# Altium schematic sheet Power_Supply_2.SchDoc
size A4
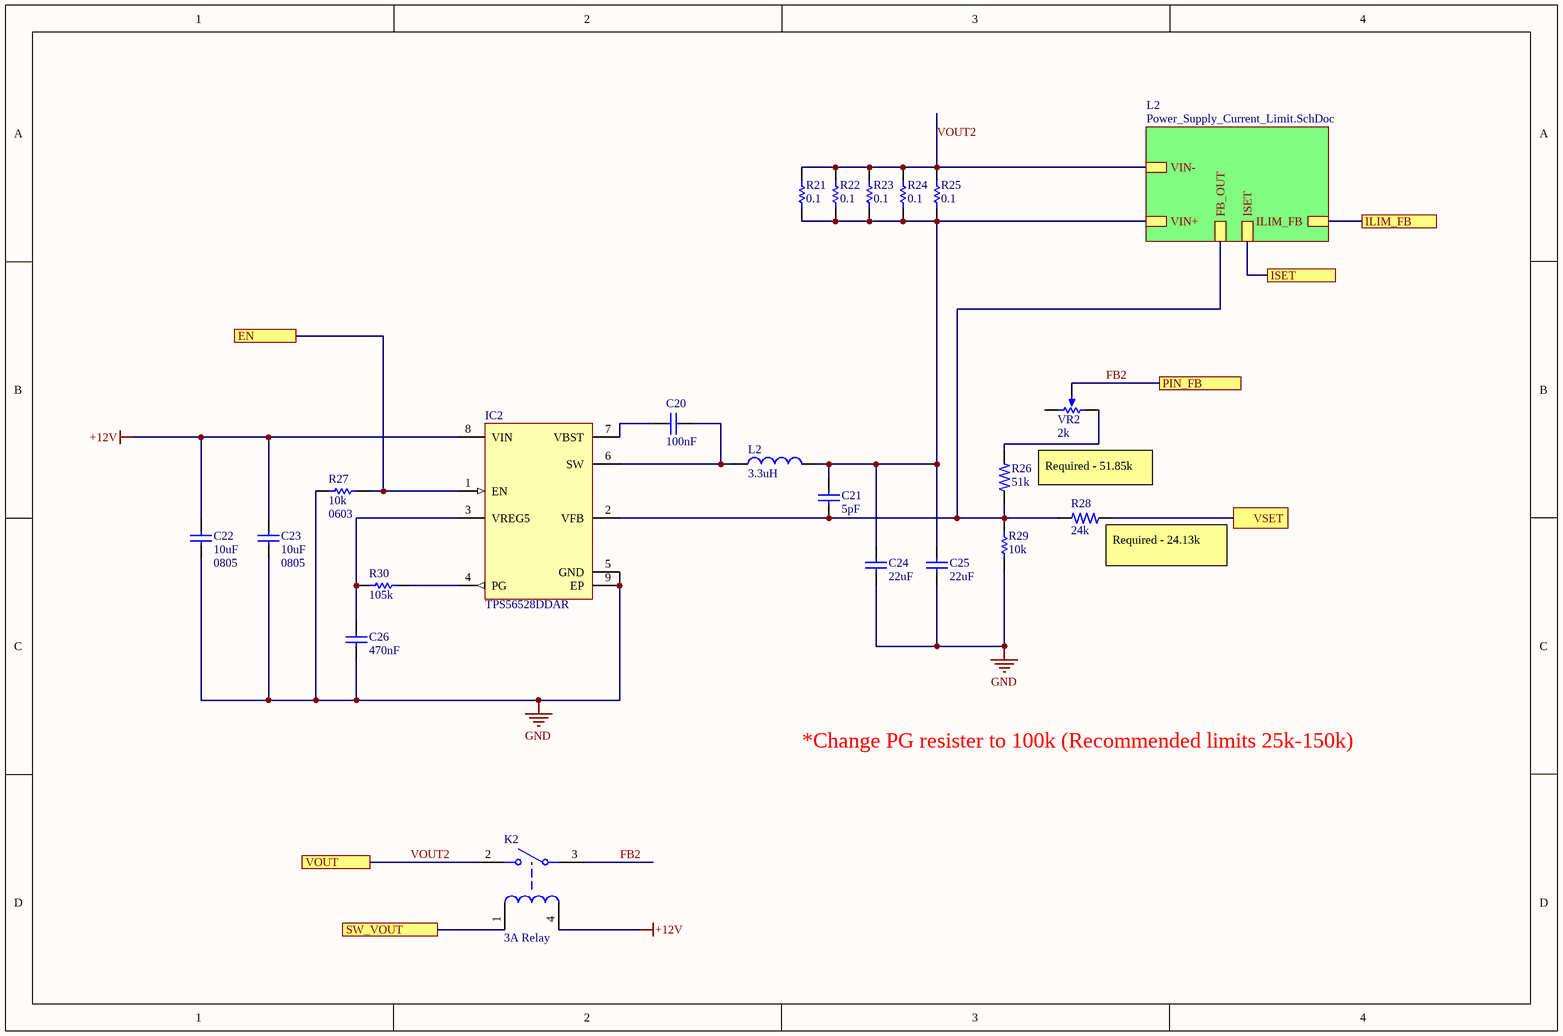
[diagram p0: Power_Supply_2.SchDoc]

## Parts
C20  100nF  [CAPC1608X09N]
C21  5pF  [CAPC1608X09N]
C22  10uF  Package / Case: 0805  [C0805]
C23  10uF  Package / Case: 0805  [C0805]
C24  22uF  [CAPC1608X09N]
C25  22uF  [CAPC1608X09N]
C26  470nF  [CAPC1608X09N]
IC2  TPS56528DDAR  [PCB-duyb6heo4lj5grkfxin6-1]
K2  3A Relay  [PCB-ei6nokn2irsc2a7yt94x-1]
L2  3.3uH  [PCB-grsryisdn8451x3s484y-1]
R21  0.1  [RESC3116X07M]
R22  0.1  [RESC3116X07M]
R23  0.1  [RESC3116X07M]
R24  0.1  [RESC3116X07M]
R25  0.1  [RESC3116X07M]
R26  51k  [PCB-3elf45qdqizoabmczrxc-1]
R27  10k  Package / Case: 0603  [gen0603-2]
R28  24k  [PCB-3elf45qdqizoabmczrxc-1]
R29  10k  [gen0603-2]
R30  105k  [gen0603-2]
VR2  2k  [PCB-5abvnr99iwiiosfurk6j-1]

## Sub-sheets
L2 = Power_Supply_Current_Limit.SchDoc: VIN-, FB_OUT, VIN+, ISET, ILIM_FB

## Ports
EN, ILIM_FB, ISET, PIN_FB, SW_VOUT, VOUT, VSET

## Nets
+12V: C22.2 C23.2 IC2.8(VIN) K2.4
GND: C22.1 C23.1 C24.1 C25.1 C26.1 IC2.5(GND) IC2.9(EP) R27.2 R29.1
EN: IC2.1(EN) R27.1 ; port EN
FB2: K2.3 VR2.2(WIPER) ; port PIN_FB
ILIM_FB: port ILIM_FB, sheet L2/ILIM_FB
ISET: port ISET, sheet L2/ISET
SW_VOUT: K2.1 ; port SW_VOUT
VOUT2: K2.2 R21.1 R22.2 R23.2 R24.2 R25.2 ; port VOUT, sheet L2/VIN-
VSET: R28.1 ; port VSET
NetC20_1: C20.1 IC2.6(SW) L2.1
NetC20_2: C20.2 IC2.7(VBST)
NetC21_1: C21.1 IC2.2(VFB) R26.1 R28.2 R29.2 ; sheet L2/FB_OUT
NetC21_2: C21.2 C24.2 C25.2 L2.2 R21.2 R22.1 R23.1 R24.1 R25.1 ; sheet L2/VIN+
NetC26_2: C26.2 IC2.3(VREG5) R30.2
NetIC2_4: IC2.4(PG) R30.1
NetR26_2: R26.2 VR2.3(CW)

Not connected (* = marked no-connect by the designer): VR2 1(CCW)

## Notes on the sheet
- Required - 51.85k
- (near R28) Required - 24.13k
- *Change PG resister to 100k (Recommended limits 25k-150k)

## Library data of the parts
C20 = CMP-2f55e5122ad9f092-5: 0603 10 nF 50 V ± 10% Tolerance X7R Surface Mount Multilayer Ceramic Capacitor; Manufacture Part Number: CC0603KRX7R9BB104; Manufacturer: YAGEO; Voltage-Rated: 50V; Capacitance Tolerance: 10%; Capacitance: 100nF; Package / Case: 0603; Supplier: LCSC; Supplier Part Number: C14663
C21 = CMP-2f55e5122ad9f092-5: 0603 10 nF 50 V ± 10% Tolerance X7R Surface Mount Multilayer Ceramic Capacitor; Manufacture Part Number: CL10C050CB8NNNC; Manufacturer: Samsung Electro-Mechanics; Capacitance Tolerance: 0.25%; Voltage-Rated: 50V; Capacitance: 5pF; Package / Case: 0603; Supplier: LCSC; Supplier Part Number: C93045
C22 C23 = CMP-135114-3: Cap Ceramic 0.1uF 50V X7R 10% SMD 0805 125C Embossed T/R; Manufacture Part Number: CL21B106KOQNNNE; Manufacturer: Samsung Electro-Mechanics; Voltage-Rated: 16V; Capacitance Tolerance: *; Capacitance: 10uF; Supplier: LCSC; Supplier Part Number: C95841
C24 C25 = CMP-2f55e5122ad9f092-5: 0603 10 nF 50 V ± 10% Tolerance X7R Surface Mount Multilayer Ceramic Capacitor; Manufacture Part Number: CL10A226MP8NUNE; Manufacturer: Samsung Electro-Mechanics; Capacitance Tolerance: 20%; Voltage-Rated: 10V; Capacitance: 22uF; Package / Case: 0603; Supplier: LCSC; Supplier Part Number: C86295
C26 = CMP-2f55e5122ad9f092-5: 0603 10 nF 50 V ± 10% Tolerance X7R Surface Mount Multilayer Ceramic Capacitor; Manufacture Part Number: CL10F474ZO8NNNC; Manufacturer: Samsung Electro-Mechanics; Voltage-Rated: 16V; Capacitance Tolerance: 10%; Capacitance: 470nF; Package / Case: 0603; Supplier: LCSC; Supplier Part Number: C318652
IC2 = CMP-073acf9bf38cd8fd-4: 4.5V to 18V Input, 5-A Synchronous Step-Down Converter with Advanced Eco-mode™ 8-SO PowerPAD -40 to 125; Manufacturer: Texas Instruments; Topology: Buck; Number of Regulated Outputs: 1; RoHS: Compliant; Manufacture Part Number: TPS56528DDAR; Supplier: LCSC; Supplier Part Number: C138716
K2 = CMP-edc624afa9603201-3: Power Relay 12VDC 3DC/5AAC SPST-NO( (20.5mm 7.2mm 15.3mm)) THT; Manufacturer: Omron Electronics; Manufacture Part Number: G5NB-1A-E-DC12; Supplier: LCSC; Supplier Part Number: C225714; Current-Rated: 3A
L2 = CMP-nvsrvemexzuzshl0ucuq-1: 3.3uH ±20% 10A 11.8m? Power Inductors; Manufacturer: SXN; Manufacture Part Number: SMMS1040-3R3M; Supplier: LCSC; Supplier Part Number: C149592; Inductance: 3.3uH; Rated Current: 10A
R21-R25 = CMP-90ca5a8d69034f0d-5: Res Thick Film 3.2 x 1.6 mm 10K Ohm 1% 0.25W(1/4W) 100ppm/ C Molded SMD Paper T/R; Manufacture Part Number: 1206W4F100LT5E; Manufacturer: UNI-ROYAL(Uniroyal Elec); Package / Case: 1206; Resistance: 0.1; Resistance Tolerance: 1%; Supplier: LCSC; Supplier Part Number: C25334
R26 = CMP-1853278-23: Surface Mount Thick Film Resistor, RC Series, 1 kohm, 100 mW, - 1%, 50 V, 0603 [1608 Metric]; Manufacturer: Walsin Tech Group; Manufacture Part Number: WR06X513 JTL; Resistance Tolerance: 1%; Package / Case: 0603; Resistance: 51k; Supplier: LCSC; Supplier Part Number: C384211
R27 R29 = CMP-1853278-27: Surface Mount Thick Film Resistor, RC Series, 1 kohm, 100 mW, - 1%, 50 V, 0603 [1608 Metric]; Manufacturer: YAGEO; Manufacture Part Number: RC0603FR-0710KL; Resistance Tolerance: 1%; Supplier: LCSC; Supplier Part Number: C98220; Resistance: 10k
  R29: Package / Case: 0603
R28 = CMP-1853278-23: Surface Mount Thick Film Resistor, RC Series, 1 kohm, 100 mW, - 1%, 50 V, 0603 [1608 Metric]; Manufacturer: UNI-ROYAL(Uniroyal Elec); Manufacture Part Number: 0603WAJ0243T5E; Resistance Tolerance: 1%; Package / Case: 0603; Resistance: 24k; Supplier: LCSC; Supplier Part Number: C25588
R30 = CMP-1853278-27: Surface Mount Thick Film Resistor, RC Series, 1 kohm, 100 mW, - 1%, 50 V, 0603 [1608 Metric]; Manufacturer: UNI-ROYAL; Manufacture Part Number: 0603WAF1053T5E; Resistance Tolerance: 1%; Supplier: LCSC; Supplier Part Number: C16840; Resistance: 105k; Package / Case: 0603
VR2 = CMP-a8df61d7bf077718-3: Res Cermet Trimmer 2K Ohm 10% 1/2W 25(Elec)Turn 2.19mm (9.53 X 4.83 X 11.55mm) Pin Thru-Hole Tube; Manufacture Part Number: 3296W-1-202; Manufacturer: BOCHEN(Chengdu Guosheng Tech); Power Rating: 500 mW; Size-Height: 10.0 mm; Supplier Part Number: C118206; Supplier: LCSC; Resistance: 2k